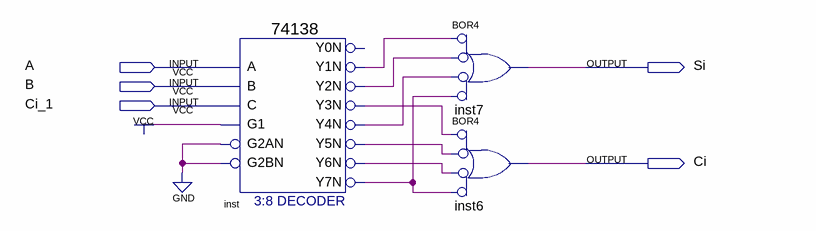
[diagram p0: schematic sheet]
// Quartus schematic lab6_3.bdf as structural Verilog: 3 symbols, 5 pins
module lab6_3 (
  input  A,
  input  B,
  input  Ci_1,
  output Si,
  output Ci
);

  wire inst_y1n, inst_y2n, inst_y3n, inst_y4n, inst_y5n, inst_y6n, inst_y7n;

  \74138  inst (
    .A(A), .B(B), .G1(1'b1), .C(Ci_1), .G2AN(1'b0), .G2BN(1'b0), .Y1N(inst_y1n), .Y2N(inst_y2n),
    .Y3N(inst_y3n), .Y4N(inst_y4n), .Y5N(inst_y5n), .Y6N(inst_y6n), .Y7N(inst_y7n));  // open: Y0N
  or inst7 (Si, ~inst_y1n, ~inst_y2n, ~inst_y4n, ~inst_y7n);  // BOR4
  or inst6 (Ci, ~inst_y3n, ~inst_y5n, ~inst_y6n, ~inst_y7n);  // BOR4
endmodule
